# Altium schematic sheet Seaglider_Power_Board_Schematic.SchDoc
size A; SheetNumber: 1; SheetTotal: 4
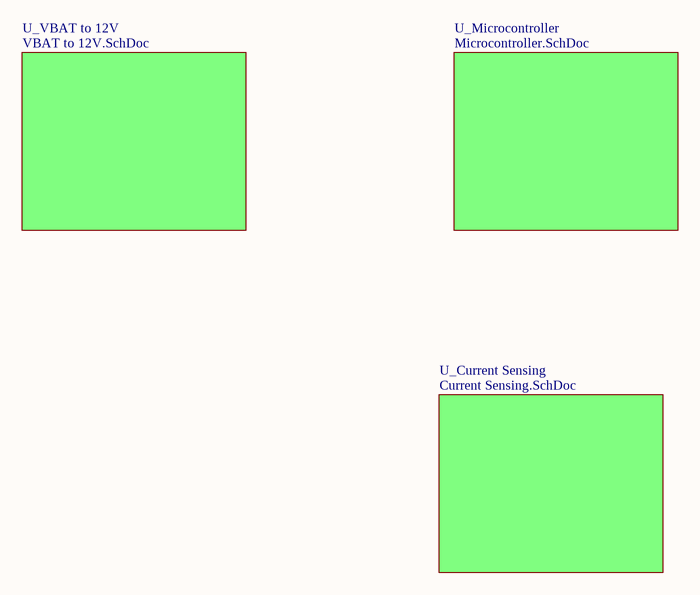
[diagram p0: Seaglider_Power_Board_Schematic.SchDoc]

## Sub-sheets
U_Current Sensing = Current Sensing.SchDoc: no entries
U_Microcontroller = Microcontroller.SchDoc: no entries
U_VBAT to 12V = VBAT to 12V.SchDoc: no entries